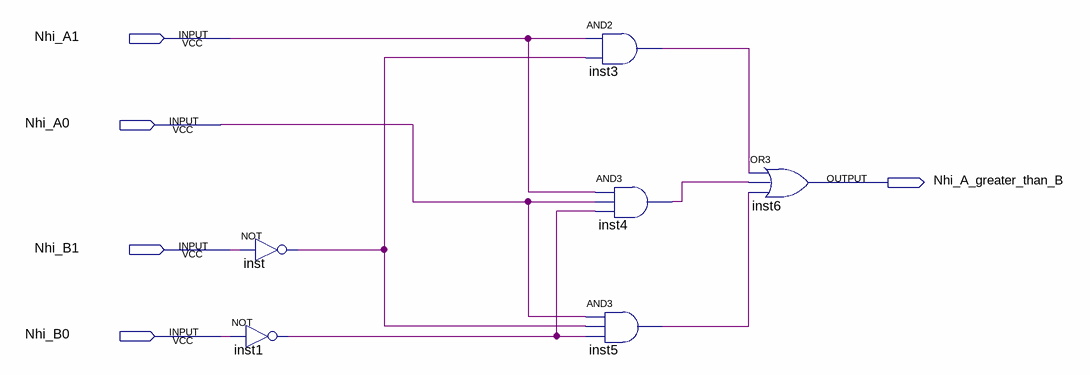
[diagram p0: schematic sheet]
// Quartus schematic Assignment1.bdf as structural Verilog: 6 symbols, 5 pins
module Assignment1 (
  input  Nhi_A1,
  input  Nhi_A0,
  input  Nhi_B1,
  input  Nhi_B0,
  output Nhi_A_greater_than_B
);

  wire inst1_out, inst3_out, inst4_out, inst5_out, inst_out;

  not inst (inst_out, Nhi_B1);
  not inst1 (inst1_out, Nhi_B0);
  and inst3 (inst3_out, Nhi_A1, inst_out);
  and inst4 (inst4_out, Nhi_A1, Nhi_A0, inst1_out);
  and inst5 (inst5_out, Nhi_A0, inst_out, inst1_out);
  or inst6 (Nhi_A_greater_than_B, inst3_out, inst4_out, inst5_out);
endmodule
